# Altium schematic sheet RESISTORS-BOARD.SchDoc
size A4
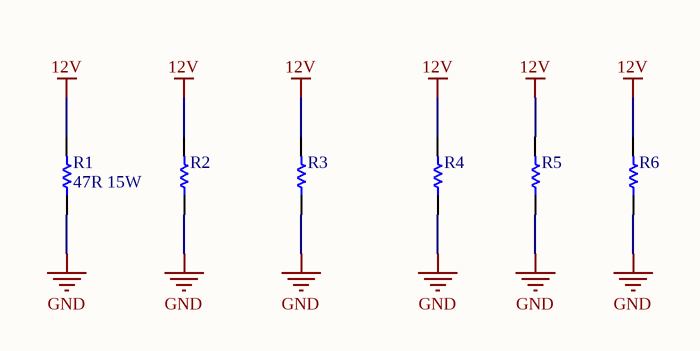
[diagram p0: RESISTORS-BOARD.SchDoc]

## Parts
R1  47R 15W  [RES-CERAMICA-15W]
R2  Resistencia Ceramica 15E 5% 15W SE15 RES.CEM  [RES-CERAMICA-15W]  (value not drawn)
R3  Resistencia Ceramica 15E 5% 15W SE15 RES.CEM  [RES-CERAMICA-15W]  (value not drawn)
R4  Resistencia Ceramica 15E 5% 15W SE15 RES.CEM  [RES-CERAMICA-15W]  (value not drawn)
R5  Resistencia Ceramica 15E 5% 15W SE15 RES.CEM  [RES-CERAMICA-15W]  (value not drawn)
R6  Resistencia Ceramica 15E 5% 15W SE15 RES.CEM  [RES-CERAMICA-15W]  (value not drawn)

## Nets
12V: R1.2 R2.2 R3.2 R4.2 R5.2 R6.2
GND: R1.1 R2.1 R3.1 R4.1 R5.1 R6.1

## Library data of the parts
R1-R6 = Resistencia Ceramica 15E 5% 15W SE15 RES.CEM: COD. ELEMON: RS4176075